# EAGLE design avrcp_m_1_2 (EAGLE 6.4)
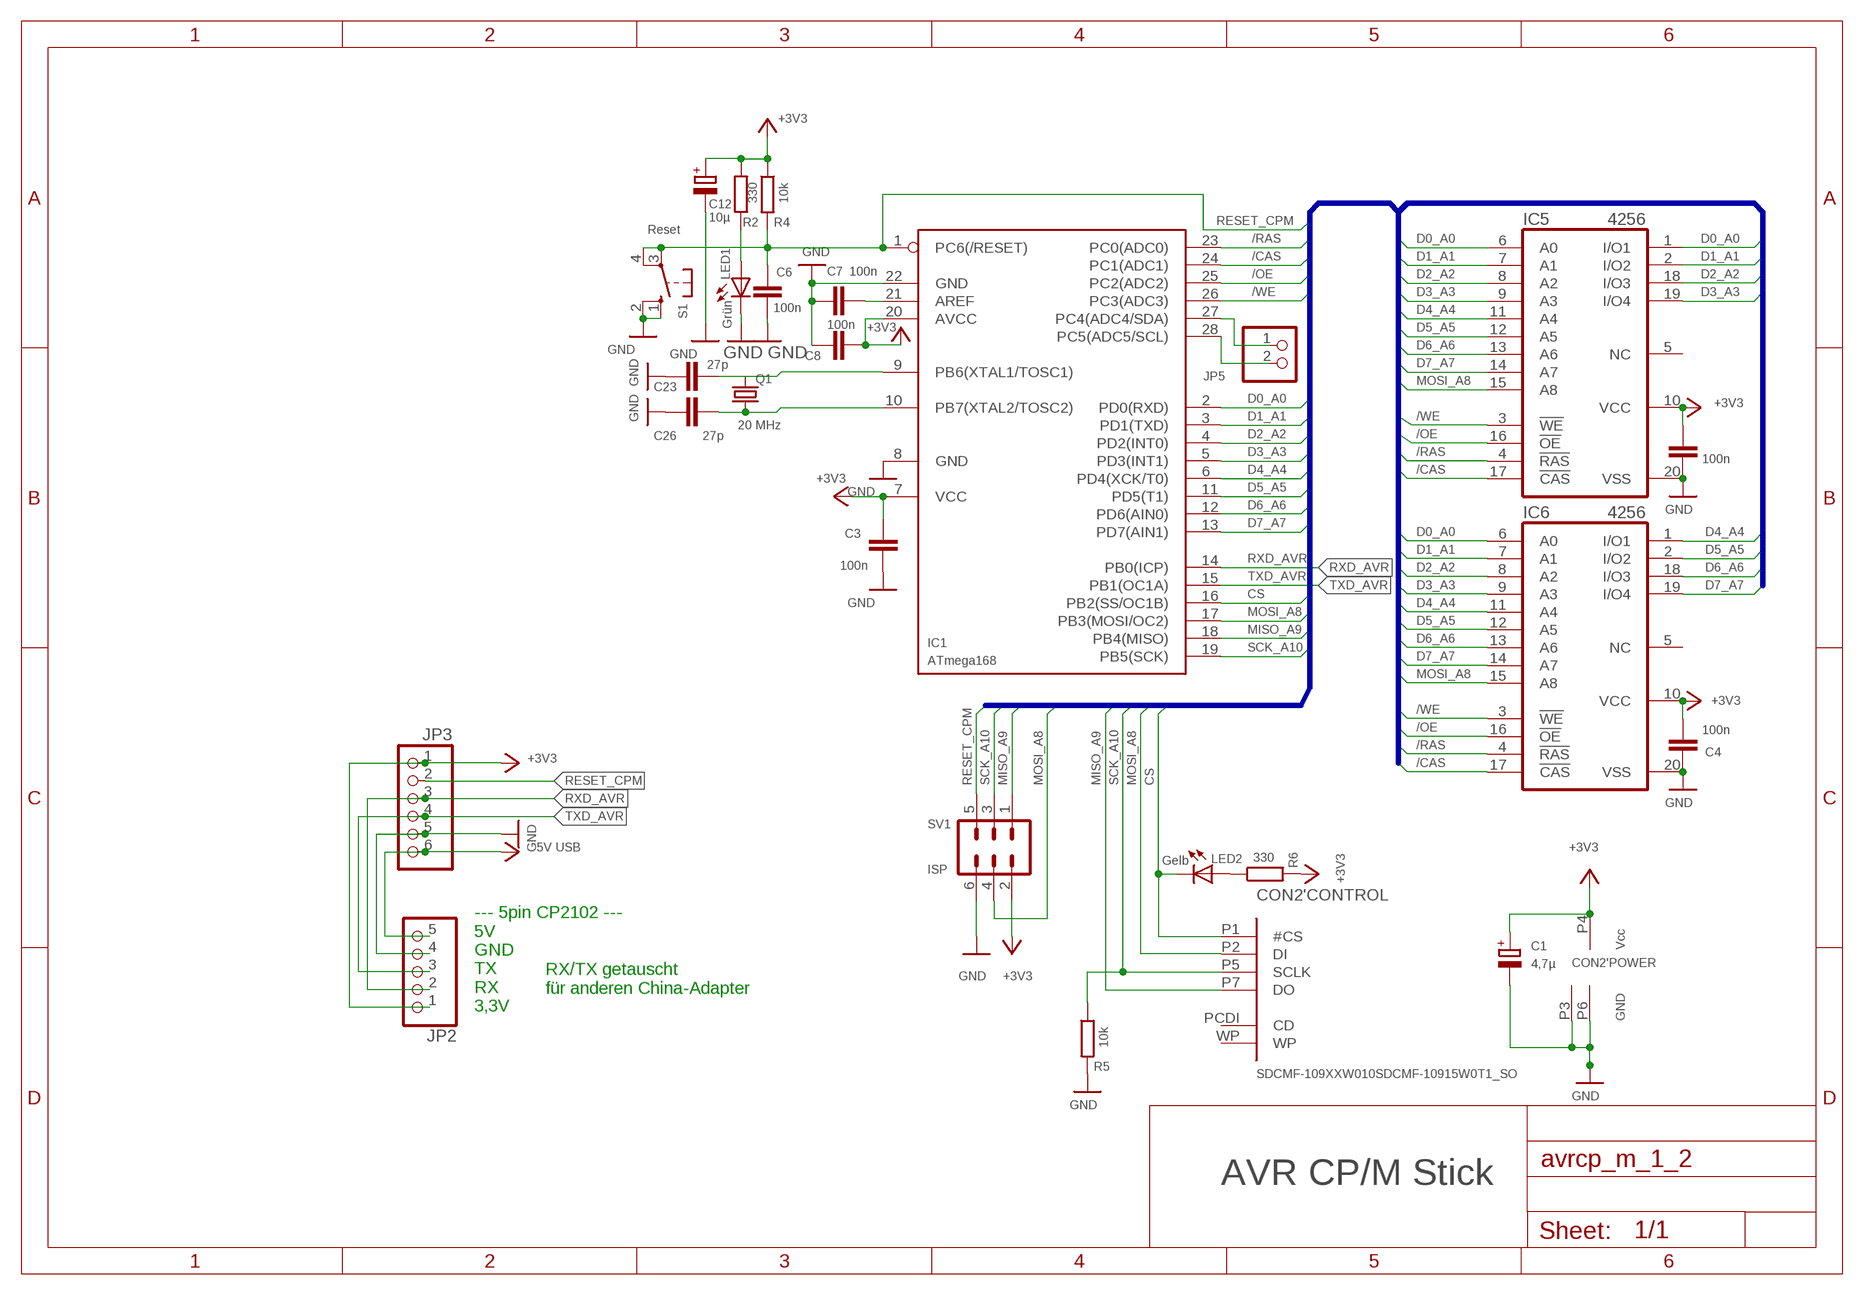
[diagram p0: schematic, sheet 1]

## Parts
C1  4,7µ  CPOL-EUE2-4  [E2-4]
C3  100n  C-EU025-024X044  [C025-024X044]
C4  100n  C-EU025-024X044  [C025-024X044]
C6  100n  C-EU025-024X044  [C025-024X044]
C7  100n  C-EU025-024X044  [C025-024X044]
C8  100n  C-EU025-024X044  [C025-024X044]
C12  10µ  CPOL-EUE2-4  [E2-4]
C15  100n  C-EU025-024X044  [C025-024X044]
C23  27p  C-EU025-024X044  [C025-024X044]
C26  27p  C-EU025-024X044  [C025-024X044]
CON2  SDCMF-109XXW010SDCMF-10915W0T1_SO  [SDCMF-10915W0T1]
IC1  ATmega168  MEGA8-P  [DIL28-3]
IC5  4256  514256ALP  [DIL20]
IC6  4256  514256ALP  [DIL20]
JP2  PINHD-1X5  [1X05]
JP3  PINHD-1X6  [1X06]
JP5  PINHD-1X2  [1X02]
LED1  Grün  LED3MM  [LED3MM]
LED2  Gelb  LED3MM  [LED3MM]
Q1  20 MHz  CRYSTALHC49S  [HC49/S]
R2  330  R-EU_0207/7  [0207/7]
R4  10k  R-EU_0207/7  [0207/7]
R5  10k  R-EU_0204/7  [0204/7]
R6  330  R-EU_0204/7  [0204/7]
S1  Reset  10-XX  [B3F-10XX]
SV1  ISP  ML6  [ML6]

## Nets
+3V3: C1.+ C3.1 C4.2 C8.1 C12.+ C15.2 CON2.P4('POWER:VCC) IC1.7(VCC) IC1.20(AVCC) IC5.10(VCC) IC6.10(VCC) JP2.1 JP3.1 R2.2 R4.1 R6.2 SV1.2
+5V: JP2.5 JP3.6 ; supply symbol labelled 5V USB
/CAS: IC1.24(PC1(ADC1)) IC5.17(!CAS) IC6.17(!CAS)
/OE: IC1.25(PC2(ADC2)) IC5.16(!OE) IC6.16(!OE)
/RAS: IC1.23(PC0(ADC0)) IC5.4(!RAS) IC6.4(!RAS)
/WE: IC1.26(PC3(ADC3)) IC5.3(!WE) IC6.3(!WE)
CS: CON2.P1('CONTROL:#CS) IC1.16(PB2(SS/OC1B)) LED2.K(C)
D0_A0: IC1.2(PD0(RXD)) IC5.1(I/O1) IC5.6(A0) IC6.6(A0)
D1_A1: IC1.3(PD1(TXD)) IC5.2(I/O2) IC5.7(A1) IC6.7(A1)
D2_A2: IC1.4(PD2(INT0)) IC5.8(A2) IC5.18(I/O3) IC6.8(A2)
D3_A3: IC1.5(PD3(INT1)) IC5.9(A3) IC5.19(I/O4) IC6.9(A3)
D4_A4: IC1.6(PD4(XCK/T0)) IC5.11(A4) IC6.1(I/O1) IC6.11(A4)
D5_A5: IC1.11(PD5(T1)) IC5.12(A5) IC6.2(I/O2) IC6.12(A5)
D6_A6: IC1.12(PD6(AIN0)) IC5.13(A6) IC6.13(A6) IC6.18(I/O3)
D7_A7: IC1.13(PD7(AIN1)) IC5.14(A7) IC6.14(A7) IC6.19(I/O4)
GND: C1.- C3.2 C4.1 C6.1 C7.2 C8.2 C12.- C15.1 C23.2 C26.2 CON2.P3('POWER:GND) CON2.P6('POWER:GND) IC1.8(GND) IC1.22(GND) IC5.20(VSS) IC6.20(VSS) JP2.4 JP3.5 LED1.K(C) R5.2 S1.1(S) S1.2(S1) SV1.6
MISO_A9: CON2.P7('CONTROL:DO) IC1.18(PB4(MISO)) SV1.1
MOSI_A8: CON2.P2('CONTROL:DI) IC1.17(PB3(MOSI/OC2)) IC5.15(A8) IC6.15(A8) SV1.4
N$3: C7.1 IC1.21(AREF)
N$5: IC1.27(PC4(ADC4/SDA)) JP5.1
N$6: IC1.28(PC5(ADC5/SCL)) JP5.2
N$7: LED1.A R2.1
N$13: LED2.A R6.1
N$23: C26.1 IC1.10(PB7(XTAL2/TOSC2)) Q1.1
N$24: C23.1 IC1.9(PB6(XTAL1/TOSC1)) Q1.2
RESET_CPM: C6.2 IC1.1(PC6(/RESET)) JP3.2 R4.2 S1.3(P) S1.4(P1) SV1.5
RXD_AVR: IC1.14(PB0(ICP)) JP2.2 JP3.3
SCK_A10: CON2.P5('CONTROL:SCLK) IC1.19(PB5(SCK)) R5.1 SV1.3
TXD_AVR: IC1.15(PB1(OC1A)) JP2.3 JP3.4
Unconnected: CON2.PCDI('CONTROL:CD) CON2.WP('CONTROL:WP) IC5.5(NC) IC6.5(NC)

## Buses
SCK_A10,MISO_A9,MOSI_A8,D7_A7,D6_A6,D5_A5,D4_A4,D3_A3,D2_A2,D1_A1,D0_A0,/WE,/OE,/RAS,/CAS,RESET_CPM,CS,SCK

## Notes on the sheet
- RX/TX getauscht
  für anderen China-Adapter
- --- 5pin CP2102 ---
  5V
  GND
  TX
  RX
  3,3V
- AVR CP/M Stick

## Library data of the parts
C1 C12 = rcl:CPOL-EU: POLARIZED CAPACITOR, European symbol
C3 C4 C6-C8 C15 C23 C26 = rcl:C-EU: CAPACITOR, European symbol
CON2 = card_adapters:SDCMF-109XXW010: KingFont SD-CARD SDCMF-109XXW010 SPI -MODE
IC1 = atmel:MEGA8-P: MICROCONTROLLER 8 Kbytes FLASH, 1 kbytes SRAM, 512 bytes EEPROM, USART, 4-channel 10 bit ADC, 2-channel 8 bit ADC Pin compatible with Atmega48, ATMega88, ATMega168 Source: avr.lbr
IC5 IC6 = memory-hitachi:514256ALP: MEMORY
JP2 = pinhead:PINHD-1X5: PIN HEADER
JP3 = pinhead:PINHD-1X6: PIN HEADER
JP5 = pinhead:PINHD-1X2: PIN HEADER
LED1 LED2 = led:LED: LED OSRAM: - CHIPLED LG R971, LG N971, LY N971, LG Q971, LY Q971, LO R971, LY R971 LH N974, LH R974 LS Q976, LO Q976, LY Q976 LO Q996 - Hyper CHIPLED LW Q18S LB Q993, LB Q99A, LB R99A - SideLED LS A670, LO A670, LY A670, LG A670, LP A670 LB A673, LV A673, LT A673, LW A673 LH A674 LY A675 LS A676, LA A676, LO A676, LY A676, LW A676 LS A679, LY A679, LG A679 - Hyper Micro SIDELED® LS Y876, LA Y876, LO Y876, LY Y876 LT Y87S - SmartLED LW L88C, LW L88S LB L89C, LB L89S, LG L890 LS L89K, LO L89K, LY L89K LS L896, LA L896, LO L896, LY L896 - TOPLED LS T670, LO T670, LY T670, LG T670, LP T670 LSG T670, LSP T670, LSY T670, LOP T670, LYG T670 LG T671, LOG T671, LSG T671 LB T673, LV T673, LT T673, LW T673 LH T674 LS T676, LA T676, LO T676, LY T676, LB T676, LH T676, LSB T676, LW T676 LB T67C, LV T67C, LT T67C, LS T67K, LO T67K, LY T67K, LW E67C LS E67B, LA E67B, LO E67B, LY E67B, LB E67C, LV E67C, LT E67C LW T67C LS T679, LY T679, LG T679 LS T770, LO T770, LY T770, LG T770, LP T770 LB T773, LV T773, LT T773, LW T773 LH T774 LS E675, LA E675, LY E675, LS T675 LS T776, LA T776, LO T776, LY T776, LB T776 LHGB T686 LT T68C, LB T68C - Hyper Mini TOPLED® LB M676 - Mini TOPLED Santana® LG M470 LS M47K, LO M47K, LY M47K Source: http://www.osram.convergy.de LUXEON: - LUMILED® LXK2-PW12-R00, LXK2-PW12-S00, LXK2-PW14-U00, LXK2-PW14-V00 LXK2-PM12-R00, LXK2-PM12-S00, LXK2-PM14-U00 LXK2-PE12-Q00, LXK2-PE12-R00, LXK2-PE12-S00, LXK2-PE14-T00, LXK2-PE14-U00 LXK2-PB12-K00, LXK2-PB12-L00, LXK2-PB12-M00, LXK2-PB14-N00, LXK2-PB14-P00, LXK2-PB14-Q00 LXK2-PR12-L00, LXK2-PR12-M00, LXK2-PR14-Q00, LXK2-PR14-R00 LXK2-PD12-Q00, LXK2-PD12-R00, LXK2-PD12-S00 LXK2-PH12-R00, LXK2-PH12-S00 LXK2-PL12-P00, LXK2-PL12-Q00, LXK2-PL12-R00 Source: www.luxeon.com KINGBRIGHT: KA-3528ASYC Source: www.kingbright.com
Q1 = crystal:CRYSTAL: CRYSTAL
R2 R4-R6 = rcl:R-EU_: RESISTOR, European symbol
S1 = switch-omron:10-XX: OMRON SWITCH
SV1 = con-harting-ml:ML6: HARTING

## Board
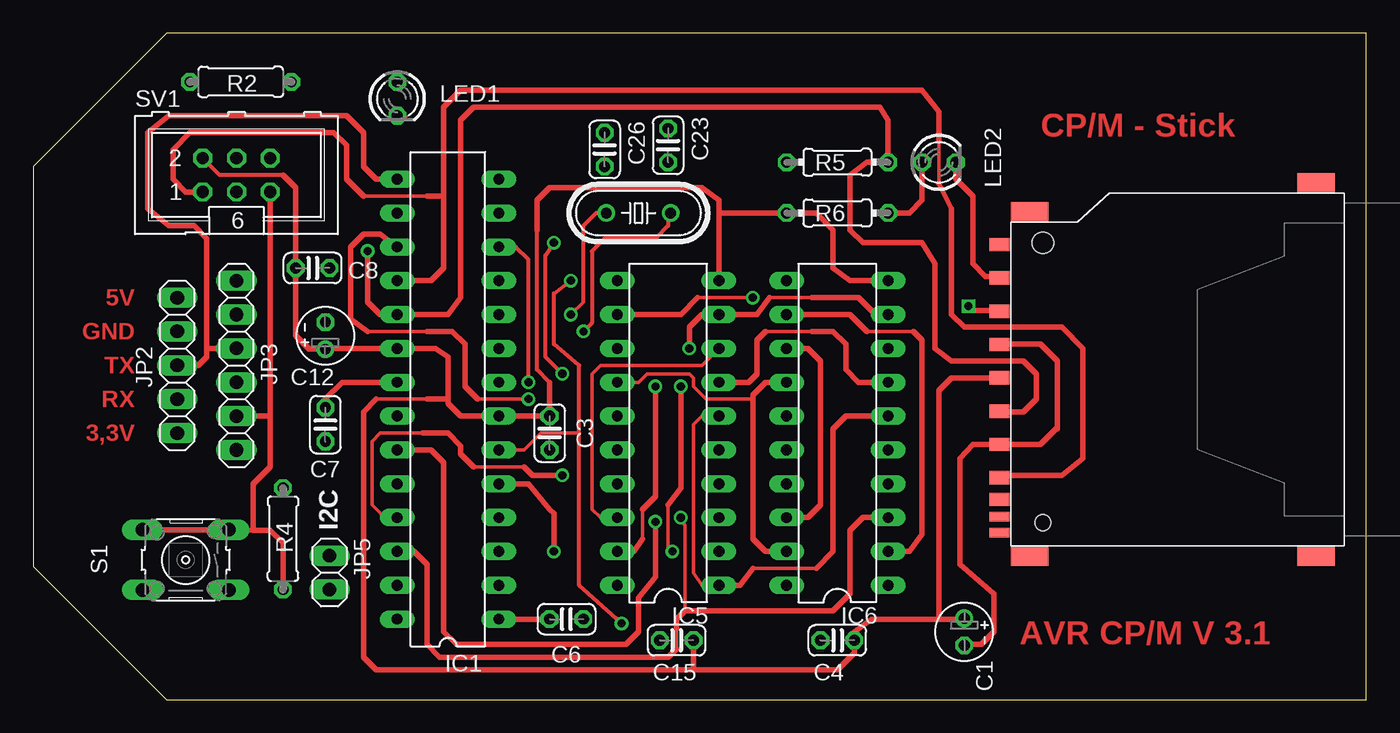
[diagram p1: board, top side]
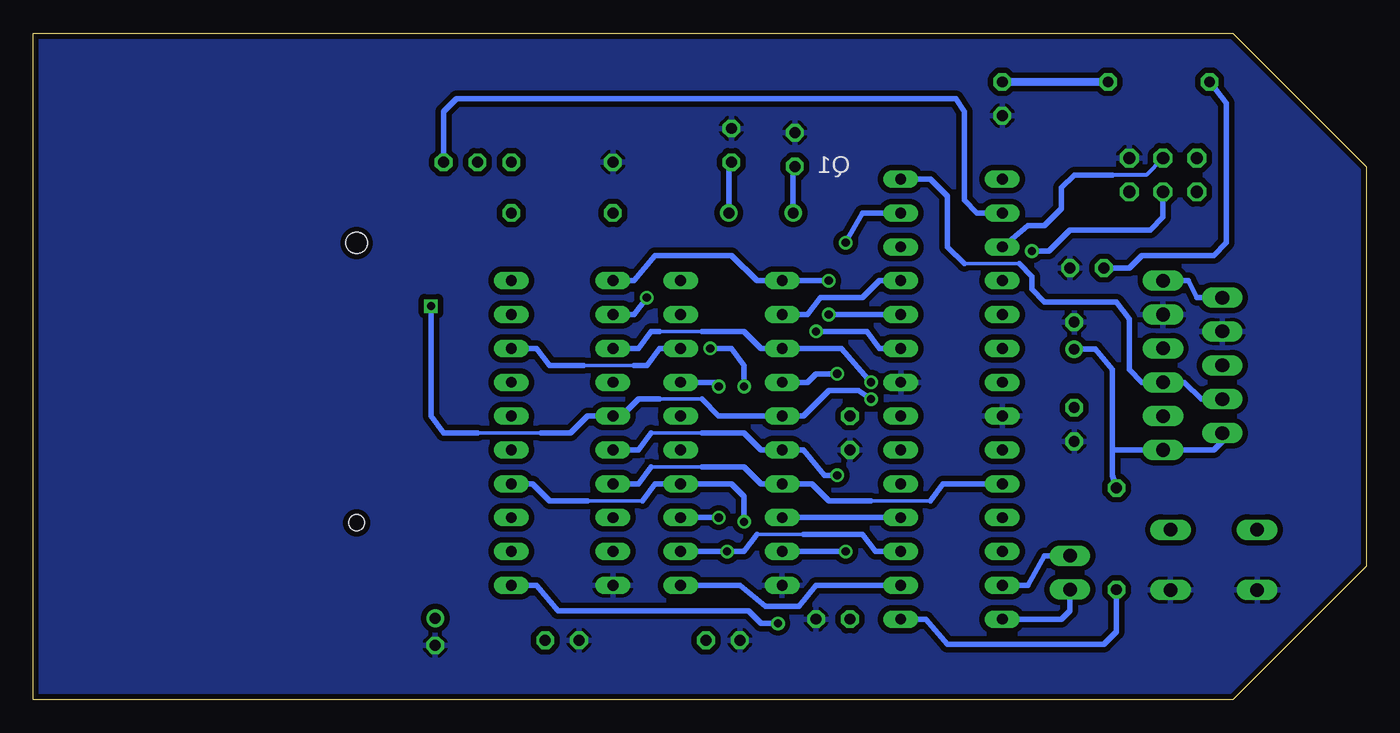
[diagram p2: board, bottom side, seen from below]

Size 100 x 50 mm. Coordinates in mm from the lower left corner, seen from the top.
Outline: 0,10 10,0 100,0 100,50 10,50 0,40 0,10
Copper layers (1*16): Top 0.035mm / dielectric 1.5mm / Bottom 0.035mm
Design rules "default *": minimum track width 10mil, minimum drill 24mil, track to track 8mil, track to pad 8mil, pad to pad 8mil, via to via 8mil, smd to smd 8mil, copper to edge 0.000025mm, drill to drill 8mil, minimum pad ring 10mil, minimum via ring 8mil, stop-mask expansion 4mil, vias tented up to drill 0mil, thermal gap 10mil

### Footprints (pad centres in the part's own frame; a part is rotated, then mirrored left to right if it is on the bottom)
E2-4 = drill 0.813 pad 1.27: + -1.016,0 | drill 0.813 pad 1.27 octagon: - 1.016,0
C025-024X044 = drill 0.813 octagon: 1 -1.27,0; 2 1.27,0
SDCMF-10915W0T1 = smd 1.5 x 2.8: F1 -14,-1.4; F2 11.8,-1.4; F3 -14,-22.9; F4 14,-22.9 | smd 1 x 1.5: P1 6.875,0.85; P2 4.375,0.85; P3 1.875,0.85; P4 -0.625,0.85; P5 -3.125,0.85; P6 -5.625,0.85; P7 -8.125,0.85; P8 -9.75,0.85; P9 9.375,0.85 | smd 0.7 x 1.5: PCDI -11.05,0.85; WP -12.25,0.85 | hole 1.6: 9.5,-2.4 | hole 1.2: -11.5,-2.4
DIL28-3 = drill 0.813 long: 1 -16.51,-3.81; 2 -13.97,-3.81; 3 -11.43,-3.81; 4 -8.89,-3.81; 5 -6.35,-3.81; 6 -3.81,-3.81; 7 -1.27,-3.81; 8 1.27,-3.81; 9 3.81,-3.81; 10 6.35,-3.81; 11 8.89,-3.81; 12 11.43,-3.81; 13 13.97,-3.81; 14 16.51,-3.81; 15 16.51,3.81; 16 13.97,3.81; 17 11.43,3.81; 18 8.89,3.81; 19 6.35,3.81; 20 3.81,3.81; 21 1.27,3.81; 22 -1.27,3.81; 23 -3.81,3.81; 24 -6.35,3.81; 25 -8.89,3.81; 26 -11.43,3.81; 27 -13.97,3.81; 28 -16.51,3.81
DIL20 = drill 0.813 long: 1 -11.43,-3.81; 2 -8.89,-3.81; 3 -6.35,-3.81; 4 -3.81,-3.81; 5 -1.27,-3.81; 6 1.27,-3.81; 7 3.81,-3.81; 8 6.35,-3.81; 9 8.89,-3.81; 10 11.43,-3.81; 11 11.43,3.81; 12 8.89,3.81; 13 6.35,3.81; 14 3.81,3.81; 15 1.27,3.81; 16 -1.27,3.81; 17 -3.81,3.81; 18 -6.35,3.81; 19 -8.89,3.81; 20 -11.43,3.81
1X05 = drill 1.016 long: 1 -5.08,0; 2 -2.54,0; 3 0,0; 4 2.54,0; 5 5.08,0
1X06 = drill 1.016 long: 1 -6.35,0; 2 -3.81,0; 3 -1.27,0; 4 1.27,0; 5 3.81,0; 6 6.35,0
1X02 = drill 1.016 long: 1 -1.27,0; 2 1.27,0
LED3MM = drill 0.813 octagon: A -1.27,0; K 1.27,0
HC49/S = drill 0.813: 1 -2.413,0; 2 2.413,0
0207/7 = drill 0.813 octagon: 1 -3.81,0; 2 3.81,0
0204/7 = drill 0.813 octagon: 1 -3.81,0; 2 3.81,0
B3F-10XX = drill 1.016 long: 1 -3.251,2.261; 2 3.251,2.261; 3 -3.251,-2.261; 4 3.251,-2.261
ML6 = drill 0.914 octagon: 1 -2.54,-1.27; 2 -2.54,1.27; 3 0,-1.27; 4 0,1.27; 5 2.54,-1.27; 6 2.54,1.27

### Placement (x,y rotation side)
C1  69.85,5.08 270 top
C3  38.73,20 270 top
C4  60.33,4.45 0 top
C6  40.01,6.03 180 top
C7  21.91,20.64 270 top
C8  20.95,32.38 0 top
C12  21.91,27.3 90 top
C15  48.26,4.45 0 top
C23  47.62,41.59 90 top
C26  42.86,41.27 90 top
CON2  73.34,24.77 90 top
IC1  31.11,22.54 90 top
IC5  47.62,20 90 top
IC6  60.33,20 90 top
JP2  10.79,25.08 90 top
JP3  15.24,25.08 90 top
JP5  22.23,9.53 270 top
LED1  27.3,45.09 270 top
LED2  67.94,40.32 0 top
Q1  45.4,36.51 0 top
R2  15.56,46.35 180 top
R4  18.73,12.06 270 top
R5  60.33,40.32 180 top
R6  60.33,36.51 180 top
S1  11.43,10.48 180 top
SV1  15.24,39.37 0 top

### Tracks (layer width: path | path; a pad name or v marks a point on that pad's centre or on a via)
+3V3
  Top 0.254: 29.53,22.54 25.72,22.54 | 69.85,6.03 C1.+ | 21.91,26.24 C12.+
  Top 0.305: SV1.2 13.97,39.37 18.73,39.37 | 37.78,35.24 37.78,24.77 38.73,23.81
  Top 0.406: 49.53,2.22 60.33,2.22 61.59,3.49 C4.2 61.59,5.08 62.87,6.03 67.94,6.03 | IC6.10 61.28,31.43 60.01,32.38 60.01,35.24 58.74,36.51 R6.2 51.44,36.51 | 31.11,22.54 31.11,25.72 30.16,26.35 IC1.20 21.91,26.35 C12.+ 20.64,26.29 20.64,26.35 19.68,27.3 C8.1 | 31.11,22.54 31.11,22.23 32.07,21.27 IC1.7 C3.1 38.73,23.81 | 51.44,36.51 51.44,37.47 50.16,38.42 38.73,38.42 37.78,37.47 37.78,35.24 | C8.1 19.68,38.42 18.73,39.37 | 31.11,22.54 29.53,22.54 | 25.72,22.54 24.77,21.59 24.77,3.17 25.72,2.22 49.53,2.22 | 49.53,2.22 C15.2 | IC5.10 51.44,36.51 | CON2.P4 68.9,24.14 67.94,23.19 67.94,6.03 | 67.94,6.03 69.85,6.03 | 19.43,32.38 C8.1
  Bottom 0.406: 19.05,18.73 JP3.1 11.43,18.73 10.79,19.37 JP2.1 | 19.05,18.73 19.05,24.77 20.32,26.29 C12.+ | C8.1 17.78,32.38 16.83,33.34 11.43,33.34 10.48,34.29 10.48,44.77 R2.2 | R4.1 19.05,16.83 19.05,18.73
+5V
  Bottom 0.406: JP2.5 12.7,30.16 13.34,31.43 JP3.6
/CAS
  Bottom 0.254: 32.7,14.92 37.15,14.92 | 49.85,17.46 53.66,17.46
  Bottom 0.406: IC1.24 31.75,16.19 32.7,14.92 | 37.15,14.92 40.32,14.92 41.59,16.19 IC5.17 45.4,16.19 46.67,17.46 49.85,17.46 | IC6.17 54.61,16.19 53.66,17.46
/OE  (via drill 0.61)
  Top 0.254: IC1.25 26.35,13.65 25.4,14.61 25.4,19.37 26.04,20 29.21,20 | 33.02,17.46 36.83,17.46
  Top 0.406: 29.21,20 31.11,20 32.07,19.05 32.07,18.41 33.02,17.46 | 36.83,17.46 37.47,16.83 v39.69,16.83
  Bottom 0.254: 49.85,20 53.66,20
  Bottom 0.406: v39.69,16.83 40.64,16.83 42.23,18.73 IC5.16 45.4,18.73 46.67,20 49.85,20 | IC6.16 54.61,18.73 53.66,20
/RAS  (via drill 0.61)
  Top 0.406: IC1.23 29.84,18.73 30.8,17.78 30.8,5.08 31.75,4.13 44.45,4.13 45.4,5.08 45.4,7.62 46.67,9.21 v46.67,13.34
  Bottom 0.254: 54.29,14.92 58.42,14.92
  Bottom 0.406: 54.29,14.92 53.34,16.19 IC5.4 47.62,16.19 46.67,15.24 v46.67,13.34 | 58.42,14.92 61.28,14.92 62.55,16.19 IC6.4
/WE  (via drill 0.61)
  Top 0.254: 48.26,3.81 48.26,5.4 | v48.58,13.65 48.9,13.02 48.9,6.67
  Top 0.406: IC1.26 28.57,11.11 29.53,10.16 29.53,4.13 30.48,3.17 47.62,3.17 48.26,3.81 | 48.26,5.4 48.26,6.03 48.9,6.67 60.01,6.67 61.28,7.94 61.28,12.7 62.23,13.65 IC6.3
  Bottom 0.406: v48.58,13.65 IC5.3
CS
  Top 0.254: 72.49,31.75 CON2.P1
  Top 0.406: 72.49,31.75 71.44,31.75 70.48,32.7 70.48,37.78 69.22,39.05 LED2.K
  Bottom 0.406: IC1.16 29.21,36.51 30.16,37.47 30.16,44.13 30.8,45.09 68.26,45.09 69.22,44.13 LED2.K
D0_A0
  Top 0.254: IC5.6 50.16,21.27 49.53,20.64 49.53,9.53 50.16,8.57 IC5.1 | 58.74,9.84 53.98,9.84
  Top 0.406: IC6.6 60.96,21.27 60.01,20.32 60.01,11.11 58.74,9.84 | 53.98,9.84 53.02,8.57 IC5.1
  Bottom 0.406: IC1.2 41.27,8.57 42.55,6.99 45.09,6.99 46.99,8.57 IC5.1
D1_A1  (via drill 0.61)
  Top 0.254: 54.93,27.62 58.42,27.62 | v47.94,11.11 47.62,11.43 47.62,14.61
  Top 0.406: IC5.7 53.66,23.81 54.29,24.45 54.29,26.99 54.93,27.62 | 58.42,27.62 60.01,27.62 60.96,26.67 60.96,24.77 61.91,23.81 IC6.7 | 47.62,14.61 48.58,15.88 v48.58,23.5
  Bottom 0.254: 42.23,12.38 45.72,12.38
  Bottom 0.406: IC1.3 36.83,11.11 37.78,12.38 42.23,12.38 | 45.72,12.38 46.67,11.11 v47.94,11.11 IC5.2 | v48.58,23.5 48.9,23.81 IC5.7
D2_A2
  Top 0.254: IC5.8 50.16,25.08 42.55,25.08 41.91,24.45 41.91,14.29 42.55,13.65 IC5.18
  Bottom 0.254: 54.93,25.08 58.74,25.08
  Bottom 0.406: IC1.4 IC5.18 | IC6.8 62.23,26.35 61.28,25.08 58.74,25.08 | 54.93,25.08 53.98,25.08 53.02,26.35 IC5.8
D3_A3  (via drill 0.61)
  Top 0.254: 55.24,30.16 58.42,30.16 58.74,30.16 | 45.72,12.06 45.72,14.29
  Top 0.406: 55.24,30.16 54.29,28.89 IC5.9 50.16,28.89 49.21,27.94 v49.21,26.35 | 58.42,30.16 61.91,30.16 63.18,28.89 IC6.9 | v39.05,11.11 39.05,13.97 38.73,14.29 37.15,16.19 IC1.5 | 45.72,14.29 46.67,15.24 v46.67,23.5 | IC5.19 45.09,11.11 45.72,12.06
  Bottom 0.406: v39.05,11.11 IC5.19 | v46.67,23.5 46.67,25.08 47.62,26.35 v49.21,26.35
D4_A4  (via drill 0.61)
  Top 0.254: IC1.6 36.83,18.73 38.1,20 40.96,20
  Top 0.305: v44.13,5.71 40.96,8.57 40.96,20 40.96,25.08 39.05,26.67 39.05,30.48 v40.32,31.43
  Bottom 0.406: IC6.11 54.93,31.43 53.34,33.34 47.62,33.34 45.72,31.43 IC5.11 v40.32,31.43 | IC6.1 62.23,8.57 60.64,6.67 46.35,6.67 45.4,5.71 v44.13,5.71
D5_A5  (via drill 0.61)
  Top 0.254: 62.55,27.62 66.04,27.62 | 49.85,30.16 v53.98,30.16
  Top 0.406: IC6.12 61.28,28.89 62.55,27.62 | 66.04,27.62 66.67,26.99 66.67,12.38 65.72,11.11 IC6.2 | IC5.12 48.58,28.89 49.85,30.16
  Bottom 0.406: IC5.12 41.91,28.89 40.96,30.16 37.78,30.16 36.51,31.43 IC1.11 | v53.98,30.16 54.93,28.89 IC6.12 56.2,28.89
D6_A6  (via drill 0.61)
  Top 0.305: IC1.12 36.2,33.97 37.15,33.02 v37.15,23.81
  Top 0.406: IC6.18 58.1,13.65 59.05,14.61 59.05,25.4 58.1,26.35 IC6.13
  Bottom 0.254: 49.85,27.62 53.02,27.62
  Bottom 0.406: IC6.13 54.61,26.35 53.66,27.62 53.02,27.62 | 49.85,27.62 46.67,27.62 45.4,26.35 IC5.13 39.37,26.35 v37.15,23.81
D7_A7  (via drill 0.61)
  Top 0.254: IC5.14 45.4,23.81 46.04,24.45 49.21,24.45 49.53,24.13 49.53,23.5 50.48,22.54 53.98,22.54
  Top 0.305: v39.05,34.29 38.42,33.34 38.42,25.72 v39.69,24.45
  Top 0.406: IC6.14 54.93,23.81 53.98,22.86 53.98,22.54 53.98,12.06 54.93,11.11 IC6.19
  Bottom 0.406: IC1.13 37.78,36.51 v39.05,34.29 | v39.69,24.45 41.27,24.45 41.91,23.81 IC5.14
GND
  Top 0.254: 72.49,26.67 CON2.P3 | 69.85,4.13 C1.-
  Top 0.406: 76.83,20.41 75.56,19.14 CON2.P6 70.48,19.14 69.53,18.1 69.53,10.16 72.07,7.94 72.07,5.08 71.12,4.13 69.85,4.13 | 76.83,20.32 76.83,20.41 | 76.83,20.41 76.83,25.4 75.56,26.67 72.49,26.67
  pour Bottom (isolate 0.406): 0,50 100,50 100,0 0,0
MISO_A9
  Top 0.254: 67.94,41.91 67.94,38.73 | 24.77,37.78 29.53,37.78 | 73.13,16.83 CON2.P7
  Top 0.406: 67.94,41.91 67.94,44.13 66.67,45.72 32.07,45.72 30.8,44.45 30.8,37.78 | 67.94,38.73 68.9,36.83 68.9,28.89 69.85,27.94 77.15,27.94 78.74,26.35 78.74,18.1 77.15,16.83 73.13,16.83 | 30.8,37.78 30.8,32.38 29.84,31.43 IC1.18 | SV1.1 11.43,38.1 10.48,39.05 10.48,41.27 11.75,42.55 22.54,42.55 23.5,41.59 23.5,39.05 24.77,37.78 | 29.53,37.78 30.8,37.78
MOSI_A8  (via drill 0.6, 0.61)
  Top 0.254: 25.08,27.62 29.53,27.62 | 33.34,22.54 v37.15,22.54
  Top 0.406: IC1.17 26.04,34.92 24.77,34.92 23.81,33.97 23.81,28.57 25.08,27.62 | 29.53,27.62 31.43,27.62 32.38,26.67 32.38,23.5 33.34,22.54 | v70.17,29.53 70.48,29.21 72.49,29.21 CON2.P2
  Bottom 0.254: 61.91,20 66.67,20 | 49.85,22.54 53.02,22.54
  Bottom 0.305: 19.05,39.37 16.51,39.37 SV1.4
  Bottom 0.406: IC1.17 25.4,35.56 24.13,35.56 22.86,36.83 22.86,38.42 21.91,39.37 19.05,39.37 | 61.91,20 59.69,20 58.42,21.27 IC6.15 55.88,21.27 54.61,22.54 53.02,22.54 | 66.67,20 69.22,20 70.17,21.27 v70.17,29.53 | 49.85,22.54 48.58,21.27 IC5.15 42.23,21.27 40.32,23.18 38.1,23.18 v37.15,22.54
N$3
  Top 0.406: C7.1 21.91,22.54 23.18,23.81 IC1.21
N$5
  Bottom 0.406: IC1.27 25.4,8.57 24.13,10.79 JP5.1
N$6
  Bottom 0.406: IC1.28 22.86,6.03 22.23,6.67 JP5.2
N$7
  Bottom 0.61: LED1.A R2.1
N$13
  Top 0.406: R6.1 65.72,36.51 66.67,37.47 LED2.A
N$23  (via drill 0.61)
  Top 0.254: v40.32,28.89 41.27,29.84
  Top 0.305: 41.27,29.84 41.27,35.56 42.23,36.51 Q1.1
  Bottom 0.406: IC1.10 v40.32,28.89 | C26.1 42.99,39.69 Q1.1
N$24  (via drill 0.6)
  Top 0.305: Q1.2 47.62,36.51 47.62,35.56 46.67,34.61 42.86,34.61 41.91,33.66 41.91,28.26 v41.27,27.62
  Bottom 0.406: v41.27,27.62 37.47,27.62 36.51,26.35 IC1.9 | C23.1 47.82,40.01 Q1.2
RESET_CPM
  Top 0.406: 17.78,21.27 SV1.5 | IC1.1 C6.2 | 17.78,21.27 JP3.2 | S1.4 S1.3 16.51,12.7 | 17.78,21.27 17.78,17.46 16.51,16.19 16.51,12.7 | R4.2 18.73,11.75 17.78,12.7 16.51,12.7
  Bottom 0.406: IC1.1 33.02,6.03 31.43,4.13 19.68,4.13 18.73,5.08 R4.2
RXD_AVR
  Bottom 0.254: 26.04,32.7 30.16,32.7
  Bottom 0.406: IC1.14 32.7,39.05 31.43,37.78 31.43,33.97 30.16,32.7 | 26.04,32.7 25.08,31.75 25.08,30.8 24.13,29.84 18.73,29.84 17.78,28.57 17.78,24.77 16.83,23.81 JP3.3 13.65,23.81 12.38,22.54 JP2.2
SCK_A10  (via drill 0.61)
  Top 0.254: 72.49,21.59 CON2.P5
  Top 0.406: v25.08,33.66 25.08,29.84 26.04,28.89 IC1.19 31.11,28.89 32.07,30.16 32.07,43.5 33.02,44.45 63.5,44.45 64.14,43.5 R5.1 62.55,40.32 61.28,39.37 61.28,35.24 62.23,34.29 66.67,34.29 67.63,32.7 67.63,26.35 68.9,25.4 74.3,25.4 75.25,24.45 75.25,22.54 74.3,21.59 72.49,21.59
  Bottom 0.406: SV1.3 15.24,36.2 16.19,35.24 22.23,35.24 23.81,33.66 v25.08,33.66
TXD_AVR
  Top 0.406: 13.02,26.35 JP3.4 | IC1.15 25.72,39.05 24.77,40.01 24.77,42.55 23.5,43.81 10.16,43.81 8.57,42.55 8.57,36.83 10.16,35.56 12.06,35.56 13.02,34.61 13.02,26.35 | 13.02,26.35 13.02,25.72 12.38,25.08 JP2.3

### Text on the board
Top: CP/M - Stick | 5V | GND | TX | RX | 3,3V | AVR CP/M V 3.1
tNames: I2C